# Altium schematic sheet CONNECTORS.SchDoc
size A3; SheetNumber: 7; SheetTotal: 8
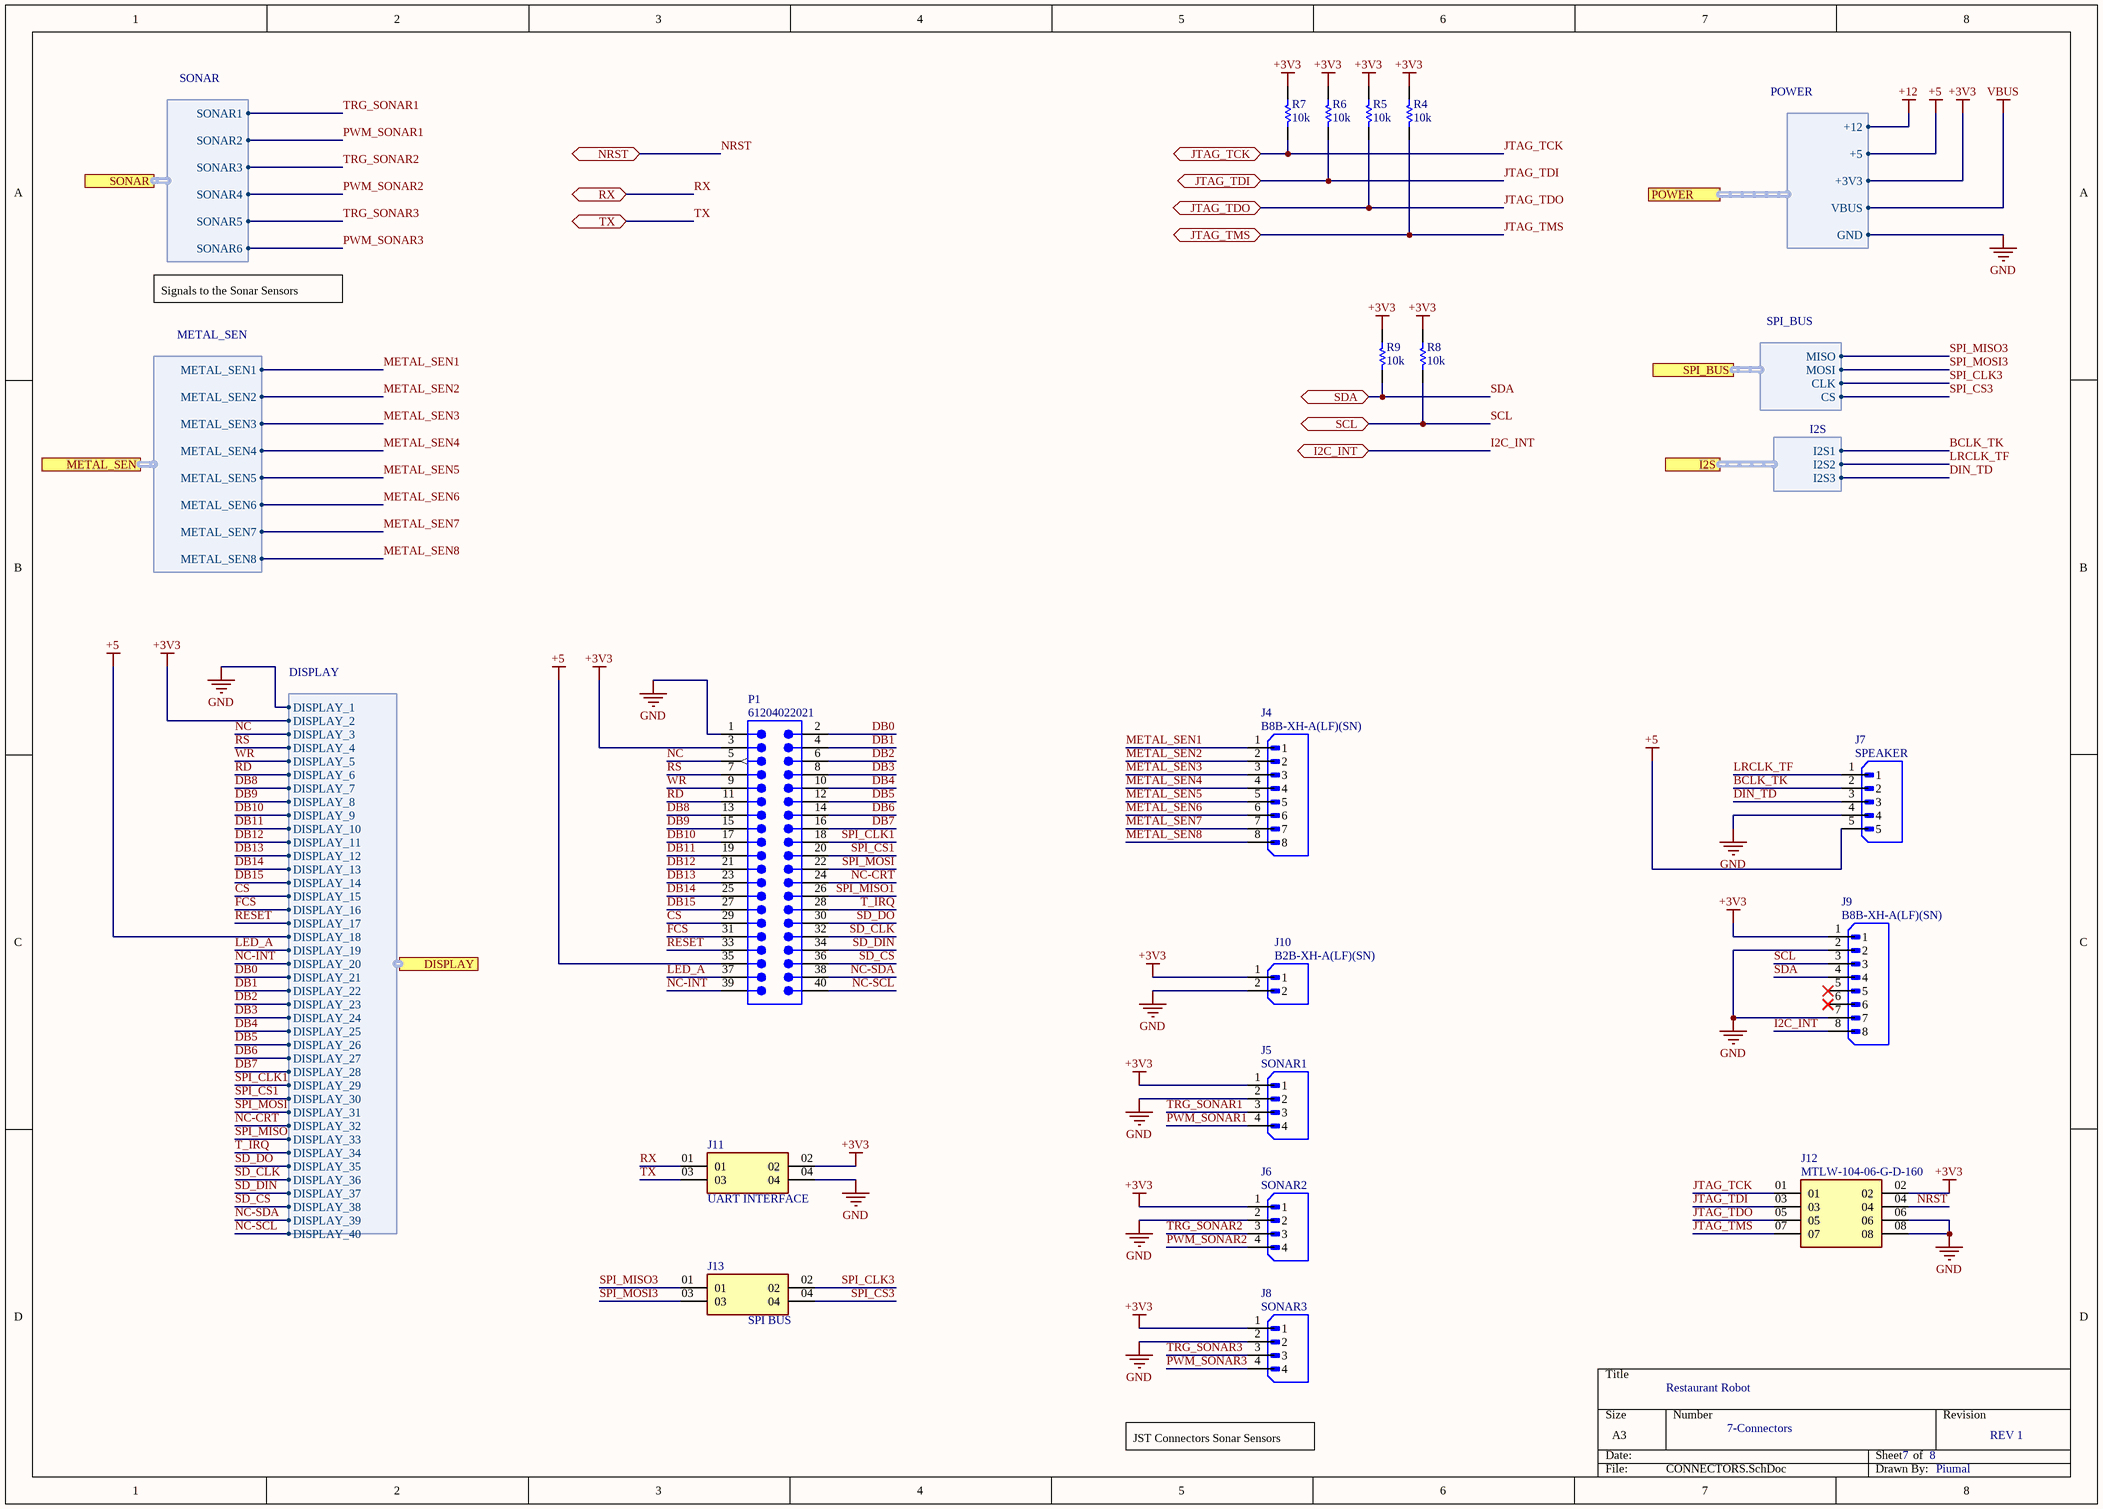
[diagram p0: CONNECTORS.SchDoc]

## Parts
J4  B8B-XH-A(LF)(SN)  [JST_B8B-XH-A(LF)(SN)]
J5  SONAR1  [JST_B4B-XH-A(LF)(SN)]
J6  SONAR2  [JST_B4B-XH-A(LF)(SN)]
J7  SPEAKER  [JST_B5B-XH-A(LF)(SN)]
J8  SONAR3  [JST_B4B-XH-A(LF)(SN)]
J9  B8B-XH-A(LF)(SN)  [JST_B8B-XH-A(LF)(SN)]
J10  B2B-XH-A(LF)(SN)  [JST_B2B-XH-A(LF)(SN)]
J11  UART INTERFACE  [SAMTEC_MTLW-102-XX-X-D-XXX]
J12  MTLW-104-06-G-D-160  [SAMTEC_MTLW-104-06-G-D-160]
J13  value SPI BUS  [SAMTEC_MTLW-102-XX-X-D-XXX]  (hidden comment: MTLW-102-XX-X-D-XXX)
P1  61204022021  [61204022021]
R4  Resistance: 10k  [RESC2013X60X35ML10T20]  (hidden comment: RC0805JR-0710KL)
R5  Resistance: 10k  [RESC2013X60X35ML10T20]  (hidden comment: RC0805JR-0710KL)
R6  Resistance: 10k  [RESC2013X60X35ML10T20]  (hidden comment: RC0805JR-0710KL)
R7  Resistance: 10k  [RESC2013X60X35ML10T20]  (hidden comment: RC0805JR-0710KL)
R8  Resistance: 10k  [RESC2013X60X35ML10T20]  (hidden comment: RC0805JR-0710KL)
R9  Resistance: 10k  [RESC2013X60X35ML10T20]  (hidden comment: RC0805JR-0710KL)

## Ports
DISPLAY (harness DISPLAY), I2C_INT (bidir), I2S (harness I2S), JTAG_TCK (bidir), JTAG_TDI (bidir), JTAG_TDO (bidir), JTAG_TMS (bidir), METAL_SEN (harness METAL_SEN), NRST (bidir), POWER (harness POWER), RX (bidir), SCL (bidir), SDA (bidir), SONAR (harness SONAR), SPI_BUS (harness SPI_BUS), TX (bidir)

## Harnesses
DISPLAY: DISPLAY_1, DISPLAY_2, DISPLAY_3, DISPLAY_4, DISPLAY_5, DISPLAY_6, DISPLAY_7, DISPLAY_8, DISPLAY_9, DISPLAY_10, DISPLAY_11, DISPLAY_12, DISPLAY_13, DISPLAY_14, DISPLAY_15, DISPLAY_16, DISPLAY_18, DISPLAY_17, DISPLAY_19, DISPLAY_20, DISPLAY_21, DISPLAY_22, DISPLAY_23, DISPLAY_24, DISPLAY_25, DISPLAY_26, DISPLAY_27, DISPLAY_28, DISPLAY_29, DISPLAY_30, DISPLAY_31, DISPLAY_32, DISPLAY_33, DISPLAY_34, DISPLAY_35, DISPLAY_36, DISPLAY_37, DISPLAY_39, DISPLAY_38, DISPLAY_40
SONAR: SONAR1, SONAR2, SONAR3, SONAR4, SONAR5, SONAR6
METAL_SEN: METAL_SEN1, METAL_SEN2, METAL_SEN3, METAL_SEN4, METAL_SEN5, METAL_SEN6, METAL_SEN7, METAL_SEN8
I2S: I2S1, I2S2, I2S3
SPI_BUS: MISO, MOSI, CLK, CS
POWER: +3V3, GND, +5, VBUS, +12

## Nets
+3V3: J5.1 J6.1 J8.1 J9.1 J10.1 J11.02 J12.02 P1.3 R4.2 R5.2 R6.2 R7.2 R8.2 R9.2 ; port DISPLAY.DISPLAY_2, port POWER.+3V3
+5: J7.5 P1.35 ; port DISPLAY.DISPLAY_18, port POWER.+5
+12: port POWER.+12
GND: J5.2 J6.2 J7.4 J8.2 J9.2 J9.7 J10.2 J11.04 J12.06 J12.08 P1.1 ; port DISPLAY.DISPLAY_1, port POWER.GND
VBUS: port POWER.VBUS
BCLK_TK: J7.2 ; port I2S.I2S1
CS: P1.29 ; port DISPLAY.DISPLAY_15
DB0: P1.2 ; port DISPLAY.DISPLAY_21
DB1: P1.4 ; port DISPLAY.DISPLAY_22
DB2: P1.6 ; port DISPLAY.DISPLAY_23
DB3: P1.8 ; port DISPLAY.DISPLAY_24
DB4: P1.10 ; port DISPLAY.DISPLAY_25
DB5: P1.12 ; port DISPLAY.DISPLAY_26
DB6: P1.14 ; port DISPLAY.DISPLAY_27
DB7: P1.16 ; port DISPLAY.DISPLAY_28
DB8: P1.13 ; port DISPLAY.DISPLAY_7
DB9: P1.15 ; port DISPLAY.DISPLAY_8
DB10: P1.17 ; port DISPLAY.DISPLAY_9
DB11: P1.19 ; port DISPLAY.DISPLAY_10
DB12: P1.21 ; port DISPLAY.DISPLAY_11
DB13: P1.23 ; port DISPLAY.DISPLAY_12
DB14: P1.25 ; port DISPLAY.DISPLAY_13
DB15: P1.27 ; port DISPLAY.DISPLAY_14
DIN_TD: J7.3 ; port I2S.I2S3
FCS: P1.31 ; port DISPLAY.DISPLAY_16
I2C_INT: J9.8 ; port I2C_INT
JTAG_TCK: J12.01 R7.1 ; port JTAG_TCK
JTAG_TDI: J12.03 R6.1 ; port JTAG_TDI
JTAG_TDO: J12.05 R5.1 ; port JTAG_TDO
JTAG_TMS: J12.07 R4.1 ; port JTAG_TMS
LED_A: P1.37 ; port DISPLAY.DISPLAY_19
LRCLK_TF: J7.1 ; port I2S.I2S2
METAL_SEN1: J4.1 ; port METAL_SEN.METAL_SEN1
METAL_SEN2: J4.2 ; port METAL_SEN.METAL_SEN2
METAL_SEN3: J4.3 ; port METAL_SEN.METAL_SEN3
METAL_SEN4: J4.4 ; port METAL_SEN.METAL_SEN4
METAL_SEN5: J4.5 ; port METAL_SEN.METAL_SEN5
METAL_SEN6: J4.6 ; port METAL_SEN.METAL_SEN6
METAL_SEN7: J4.7 ; port METAL_SEN.METAL_SEN7
METAL_SEN8: J4.8 ; port METAL_SEN.METAL_SEN8
NC: P1.5 ; port DISPLAY.DISPLAY_3
NC-CRT: P1.24 ; port DISPLAY.DISPLAY_32
NC-INT: P1.39 ; port DISPLAY.DISPLAY_20
NC-SCL: P1.40 ; port DISPLAY.DISPLAY_40
NC-SDA: P1.38 ; port DISPLAY.DISPLAY_39
NRST: J12.04 ; port NRST
PWM_SONAR1: J5.4 ; port SONAR.SONAR2
PWM_SONAR2: J6.4 ; port SONAR.SONAR4
PWM_SONAR3: J8.4 ; port SONAR.SONAR6
RD: P1.11 ; port DISPLAY.DISPLAY_6
RESET: P1.33 ; port DISPLAY.DISPLAY_17
RS: P1.7 ; port DISPLAY.DISPLAY_4
RX: J11.01 ; port RX
SCL: J9.3 R8.1 ; port SCL
SD_CLK: P1.32 ; port DISPLAY.DISPLAY_36
SD_CS: P1.36 ; port DISPLAY.DISPLAY_38
SD_DIN: P1.34 ; port DISPLAY.DISPLAY_37
SD_DO: P1.30 ; port DISPLAY.DISPLAY_35
SDA: J9.4 R9.1 ; port SDA
SPI_CLK1: P1.18 ; port DISPLAY.DISPLAY_29
SPI_CLK3: J13.02 ; port SPI_BUS.CLK
SPI_CS1: P1.20 ; port DISPLAY.DISPLAY_30
SPI_CS3: J13.04 ; port SPI_BUS.CS
SPI_MISO1: P1.26 ; port DISPLAY.DISPLAY_33
SPI_MISO3: J13.01 ; port SPI_BUS.MISO
SPI_MOSI: P1.22 ; port DISPLAY.DISPLAY_31
SPI_MOSI3: J13.03 ; port SPI_BUS.MOSI
T_IRQ: P1.28 ; port DISPLAY.DISPLAY_34
TRG_SONAR1: J5.3 ; port SONAR.SONAR1
TRG_SONAR2: J6.3 ; port SONAR.SONAR3
TRG_SONAR3: J8.3 ; port SONAR.SONAR5
TX: J11.03 ; port TX
WR: P1.9 ; port DISPLAY.DISPLAY_5

Not connected (* = marked no-connect by the designer): J9 5* 6*

## Notes on the sheet
- Signals to the Sonar Sensors
- Restaurant Robot
- JST Connectors Sonar Sensors
- 7-Connectors
- 7
- 8
- REV 1
- Piumal

## Library data of the parts
J4 J9 = B8B-XH-A(LF)(SN): Connector Header Through Hole 8 position 0.098 (2.50mm); MF: JST Sales America Inc.; SnapEDA_Link: https://www.snapeda.com/parts/B8B-XH-A(LF)(SN)/JST+Sales+America+Inc./view-part/?ref=snap; Package: None; Value: *; MP: B8B-XH-A(LF)(SN); Check_prices: https://www.snapeda.com/parts/B8B-XH-A(LF)(SN)/JST+Sales+America+Inc./view-part/?ref=eda
J5 J6 J8 = B4B-XH-A(LF)(SN): Connector Header Through Hole 4 position 0.098 (2.50mm); MF: JST Sales; SnapEDA_Link: https://www.snapeda.com/parts/B4B-XH-A(LF)(SN)/JST+Sales+America+Inc./view-part/?ref=snap; Package: None; Value: *; MP: B4B-XH-A(LF)(SN); Check_prices: https://www.snapeda.com/parts/B4B-XH-A(LF)(SN)/JST+Sales+America+Inc./view-part/?ref=eda
J7 = B5B-XH-A(LF)(SN): Connector Header Through Hole 5 position 0.098 (2.50mm); MF: JST Sales America Inc.; SnapEDA_Link: https://www.snapeda.com/parts/B5B-XH-A(LF)(SN)/JST+Sales+America+Inc./view-part/?ref=snap; Package: None; Value: *; MP: B5B-XH-A(LF)(SN); Check_prices: https://www.snapeda.com/parts/B5B-XH-A(LF)(SN)/JST+Sales+America+Inc./view-part/?ref=eda
J10 = B2B-XH-A(LF)(SN): Connector Header Through Hole 2 position 0.098 (2.50mm); MF: JST Sales; SnapEDA_Link: https://www.snapeda.com/parts/B2B-XH-A(LF)(SN)/JST/view-part/?ref=snap; Package: None; Value: *; MP: B2B-XH-A(LF)(SN); Check_prices: https://www.snapeda.com/parts/B2B-XH-A(LF)(SN)/JST/view-part/?ref=eda
J11 J13 = MTLW-102-XX-X-D-XXX: Connector Header Through Hole 4 position 0.100 (2.54mm); MF: Samtec; MP: MTLW-102-05-G-D-180; SnapEDA_Link: https://www.snapeda.com/parts/MTLW-102-05-G-D-180/Samtec/view-part/?ref=snap; Package: None; Check_prices: https://www.snapeda.com/parts/MTLW-102-05-G-D-180/Samtec/view-part/?ref=eda
P1 = CMP-1502-00074-2: NexarPartId: 32855492; Connector Type: Male Pin; Contact Resistance: 20mΩ; Gender: Male; Pitch: 2.54mm; Current Rating: 3A; Insulation Resistance: 1GΩ; Number of Positions: 40; Operating Supply Voltage: 250V; Orientation: Vertical; Number of Rows: 2; Contact Material: Copper; Fastening Type: Latch; Row Spacing: 2.54mm; RoHS: Compliant; Min Operating Temperature: -40°C; REACH SVHC: Unknown; Max Operating Temperature: 105°C; Insulation Material: PBT; Color: Black; Contact Mating Length: 5.6896mm; Number of Pins: 40; Contact Plating: Gold; Lead Pitch: 2.54mm; Length: 70.3mm; Termination: Solder; Mount: Through Hole; Number of Contacts: 40
R4-R9 = CMP-2000-05025-1: Chip Resistor, 10 KOhm, +/- 5%, 0.125 W, -55 to 155 degC, 0805 (2012 Metric), RoHS, Tape and Reel; Manufacturer: Yageo; Resistor Element Type: ThickFilm; Voltage Rating: 150V; Product Range: RCSeries; SVHC: ToBeAdvised; Resistor Case Style: 0805[2012Metric]; Temperature Coefficient: ±100ppm/degC; Power Rating: 250mW; Automotive Qualification Standard: -; Datasheet Version: REV. 2, 09/2004; Packaging: CutTape; Resistance Tolerance: ±5%; MSL: MSL1-Unlimited; Manufacturer URL: http://www.yageo.com/; Datasheet URL: http://www.yageo.ru/pdf/RC0805.pdf; Package Description: 2-Pin Surface Mounted Device, Body 2 x 1.25 mm; Package Reference: 805
J12 = MTLW-104-06-G-D-160: Value: *; Availability: Unavailable; Price: None; MP: MTLW-104-06-G-D-160; Package: None